# Altium schematic sheet LEDMatrix.SchDoc
size A2
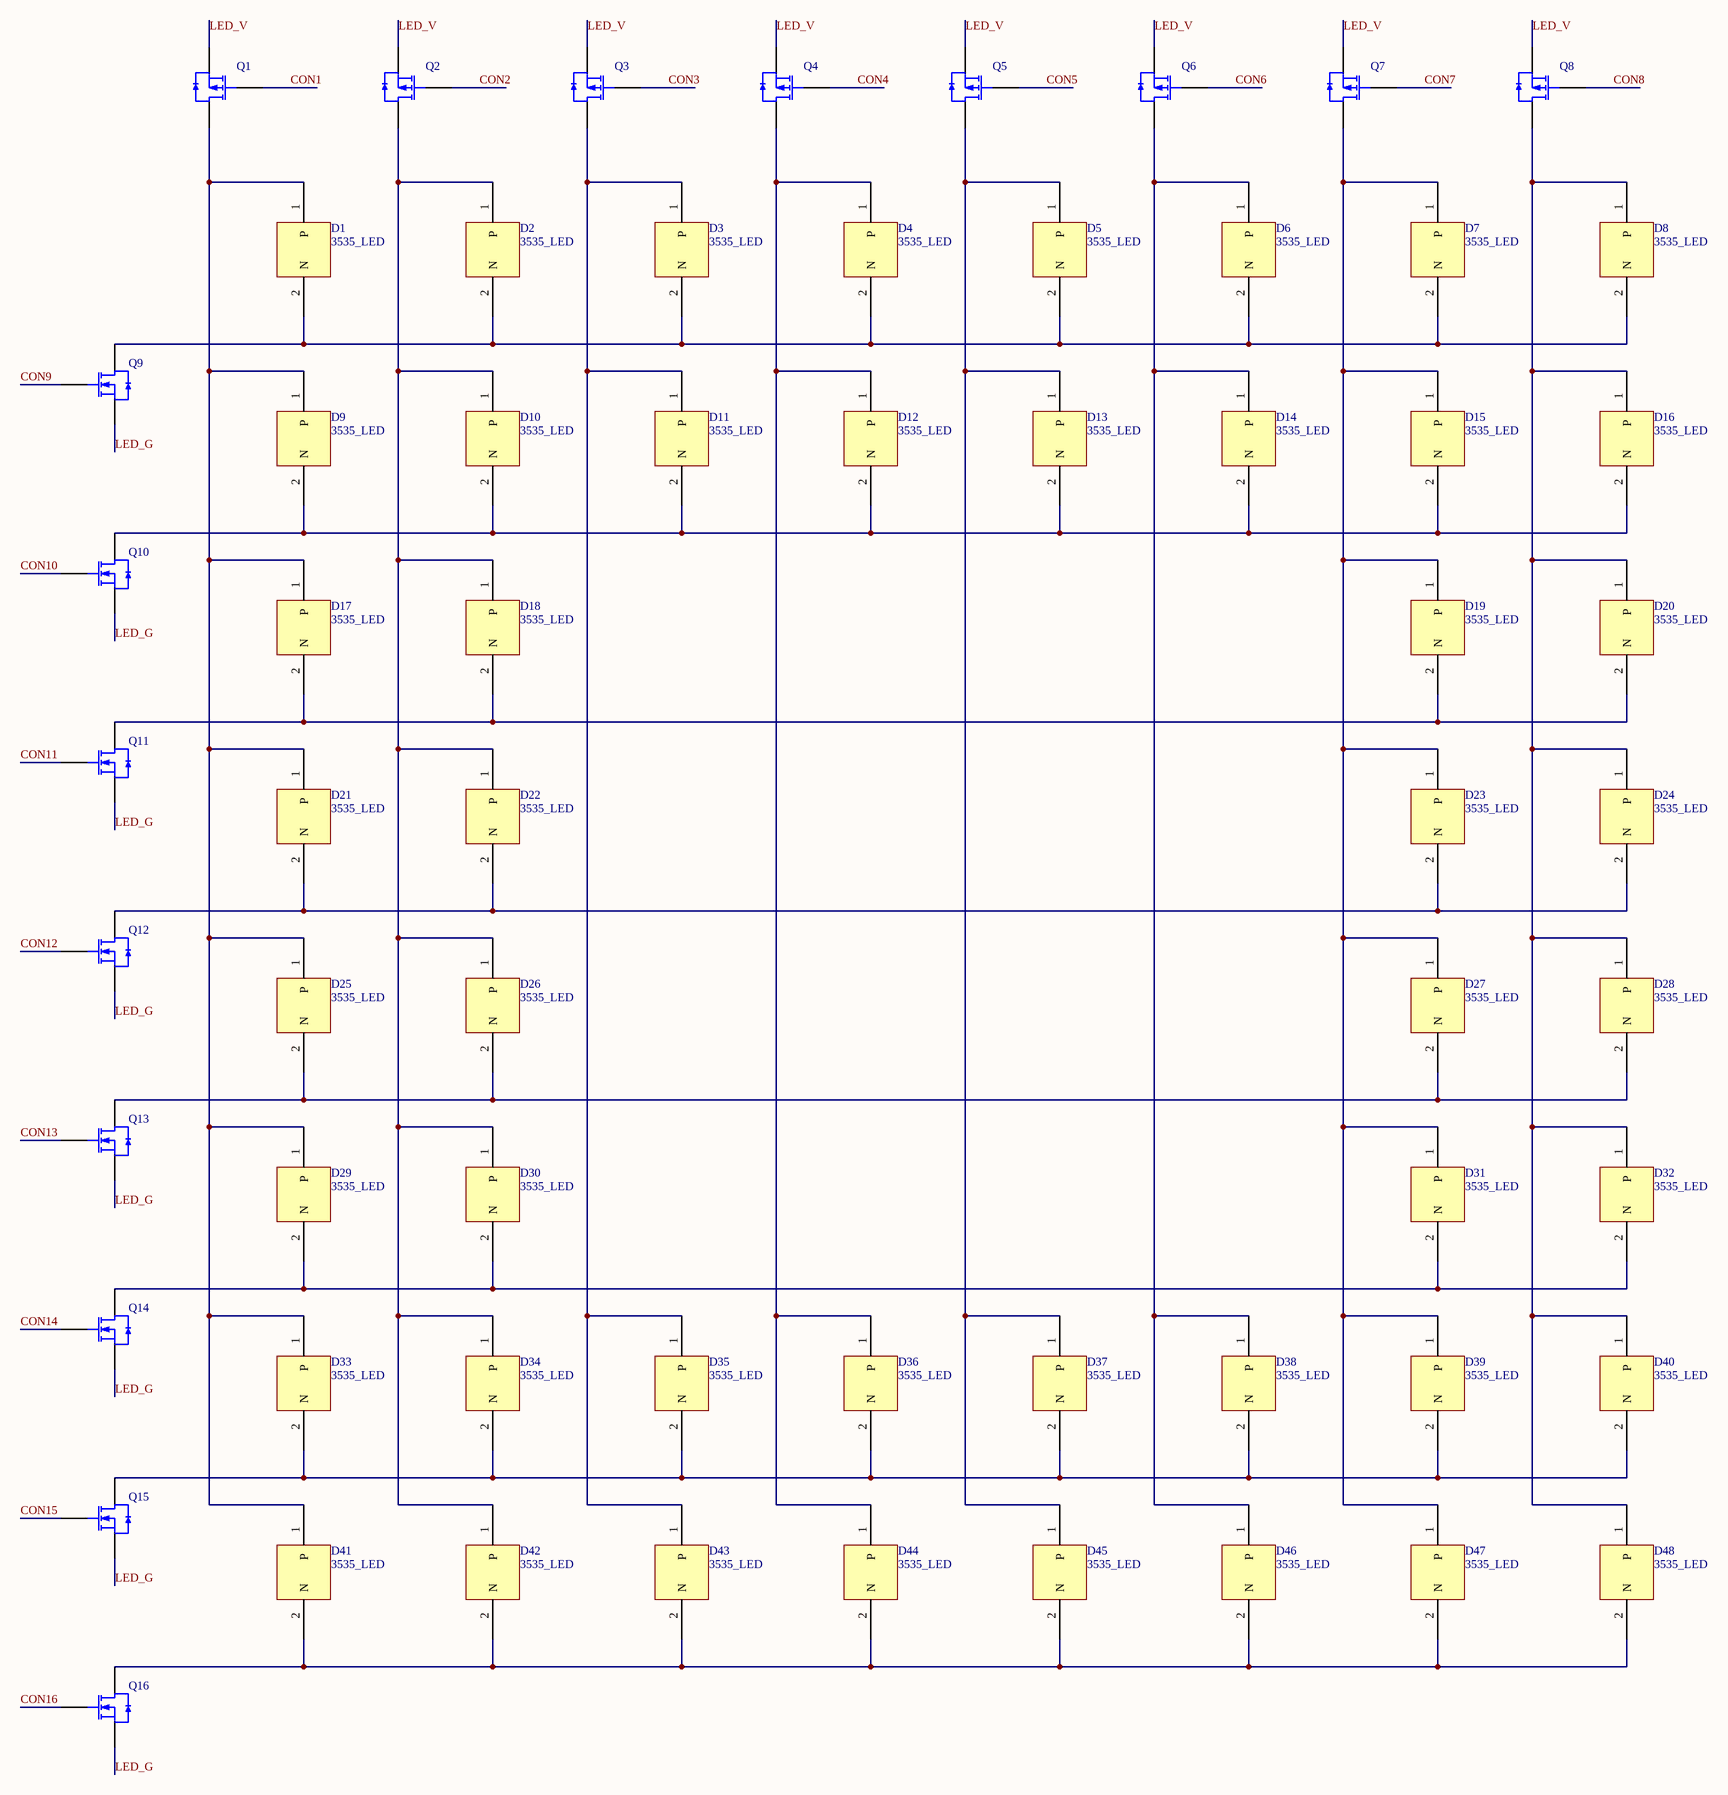
[diagram p0: LEDMatrix.SchDoc]

## Parts
D1  3535_LED  [3535_LED]
D2  3535_LED  [3535_LED]
D3  3535_LED  [3535_LED]
D4  3535_LED  [3535_LED]
D5  3535_LED  [3535_LED]
D6  3535_LED  [3535_LED]
D7  3535_LED  [3535_LED]
D8  3535_LED  [3535_LED]
D9  3535_LED  [3535_LED]
D10  3535_LED  [3535_LED]
D11  3535_LED  [3535_LED]
D12  3535_LED  [3535_LED]
D13  3535_LED  [3535_LED]
D14  3535_LED  [3535_LED]
D15  3535_LED  [3535_LED]
D16  3535_LED  [3535_LED]
D17  3535_LED  [3535_LED]
D18  3535_LED  [3535_LED]
D19  3535_LED  [3535_LED]
D20  3535_LED  [3535_LED]
D21  3535_LED  [3535_LED]
D22  3535_LED  [3535_LED]
D23  3535_LED  [3535_LED]
D24  3535_LED  [3535_LED]
D25  3535_LED  [3535_LED]
D26  3535_LED  [3535_LED]
D27  3535_LED  [3535_LED]
D28  3535_LED  [3535_LED]
D29  3535_LED  [3535_LED]
D30  3535_LED  [3535_LED]
D31  3535_LED  [3535_LED]
D32  3535_LED  [3535_LED]
D33  3535_LED  [3535_LED]
D34  3535_LED  [3535_LED]
D35  3535_LED  [3535_LED]
D36  3535_LED  [3535_LED]
D37  3535_LED  [3535_LED]
D38  3535_LED  [3535_LED]
D39  3535_LED  [3535_LED]
D40  3535_LED  [3535_LED]
D41  3535_LED  [3535_LED]
D42  3535_LED  [3535_LED]
D43  3535_LED  [3535_LED]
D44  3535_LED  [3535_LED]
D45  3535_LED  [3535_LED]
D46  3535_LED  [3535_LED]
D47  3535_LED  [3535_LED]
D48  3535_LED  [3535_LED]
Q1  AO3401A P道沟 X13A15 SOT-23  [LC-SOT-23-3L]  (value not drawn)
Q2  AO3401A P道沟 X13A15 SOT-23  [LC-SOT-23-3L]  (value not drawn)
Q3  AO3401A P道沟 X13A15 SOT-23  [LC-SOT-23-3L]  (value not drawn)
Q4  AO3401A P道沟 X13A15 SOT-23  [LC-SOT-23-3L]  (value not drawn)
Q5  AO3401A P道沟 X13A15 SOT-23  [LC-SOT-23-3L]  (value not drawn)
Q6  AO3401A P道沟 X13A15 SOT-23  [LC-SOT-23-3L]  (value not drawn)
Q7  AO3401A P道沟 X13A15 SOT-23  [LC-SOT-23-3L]  (value not drawn)
Q8  AO3401A P道沟 X13A15 SOT-23  [LC-SOT-23-3L]  (value not drawn)
Q9  AO3400A N道沟 X0YV1T SOT-23  [SOT-23-3L]  (value not drawn)
Q10  AO3400A N道沟 X0YV1T SOT-23  [SOT-23-3L]  (value not drawn)
Q11  AO3400A N道沟 X0YV1T SOT-23  [SOT-23-3L]  (value not drawn)
Q12  AO3400A N道沟 X0YV1T SOT-23  [SOT-23-3L]  (value not drawn)
Q13  AO3400A N道沟 X0YV1T SOT-23  [SOT-23-3L]  (value not drawn)
Q14  AO3400A N道沟 X0YV1T SOT-23  [SOT-23-3L]  (value not drawn)
Q15  AO3400A N道沟 X0YV1T SOT-23  [SOT-23-3L]  (value not drawn)
Q16  AO3400A N道沟 X0YV1T SOT-23  [SOT-23-3L]  (value not drawn)

## Nets
CON1: Q1.1(G)
CON2: Q2.1(G)
CON3: Q3.1(G)
CON4: Q4.1(G)
CON5: Q5.1(G)
CON6: Q6.1(G)
CON7: Q7.1(G)
CON8: Q8.1(G)
CON9: Q9.1(G)
CON10: Q10.1(G)
CON11: Q11.1(G)
CON12: Q12.1(G)
CON13: Q13.1(G)
CON14: Q14.1(G)
CON15: Q15.1(G)
CON16: Q16.1(G)
LED_G: Q9.2(S) Q10.2(S) Q11.2(S) Q12.2(S) Q13.2(S) Q14.2(S) Q15.2(S) Q16.2(S)
LED_V: Q1.2(S) Q2.2(S) Q3.2(S) Q4.2(S) Q5.2(S) Q6.2(S) Q7.2(S) Q8.2(S)
NetD1_1: D1.1(P) D9.1(P) D17.1(P) D21.1(P) D25.1(P) D29.1(P) D33.1(P) D41.1(P) Q1.3(D)
NetD1_2: D1.2(N) D2.2(N) D3.2(N) D4.2(N) D5.2(N) D6.2(N) D7.2(N) D8.2(N) Q9.3(D)
NetD2_1: D2.1(P) D10.1(P) D18.1(P) D22.1(P) D26.1(P) D30.1(P) D34.1(P) D42.1(P) Q2.3(D)
NetD3_1: D3.1(P) D11.1(P) D35.1(P) D43.1(P) Q3.3(D)
NetD4_1: D4.1(P) D12.1(P) D36.1(P) D44.1(P) Q4.3(D)
NetD5_1: D5.1(P) D13.1(P) D37.1(P) D45.1(P) Q5.3(D)
NetD6_1: D6.1(P) D14.1(P) D38.1(P) D46.1(P) Q6.3(D)
NetD7_1: D7.1(P) D15.1(P) D19.1(P) D23.1(P) D27.1(P) D31.1(P) D39.1(P) D47.1(P) Q7.3(D)
NetD8_1: D8.1(P) D16.1(P) D20.1(P) D24.1(P) D28.1(P) D32.1(P) D40.1(P) D48.1(P) Q8.3(D)
NetD9_2: D9.2(N) D10.2(N) D11.2(N) D12.2(N) D13.2(N) D14.2(N) D15.2(N) D16.2(N) Q10.3(D)
NetD17_2: D17.2(N) D18.2(N) D19.2(N) D20.2(N) Q11.3(D)
NetD21_2: D21.2(N) D22.2(N) D23.2(N) D24.2(N) Q12.3(D)
NetD25_2: D25.2(N) D26.2(N) D27.2(N) D28.2(N) Q13.3(D)
NetD29_2: D29.2(N) D30.2(N) D31.2(N) D32.2(N) Q14.3(D)
NetD33_2: D33.2(N) D34.2(N) D35.2(N) D36.2(N) D37.2(N) D38.2(N) D39.2(N) D40.2(N) Q15.3(D)
NetD41_2: D41.2(N) D42.2(N) D43.2(N) D44.2(N) D45.2(N) D46.2(N) D47.2(N) D48.2(N) Q16.3(D)

## Library data of the parts
Q1-Q8 = AO3401A P道沟 X13A15 SOT-23: MOS(场效应管); ComponentLink1Description: 供应商链接; ComponentLink1URL: http://www.szlcsc.com/product/details_15801.html; Package: SOT-23; Supplier: LC; SuppliersPartNumber: C15127
Q9-Q16 = AO3400A N道沟 X0YV1T SOT-23: MOS(场效应管); ComponentLink1Description: 供应商链接; ComponentLink1URL: http://www.szlcsc.com/product/details_21629.html; Package: SOT-23; Supplier: LC; SuppliersPartNumber: C20917